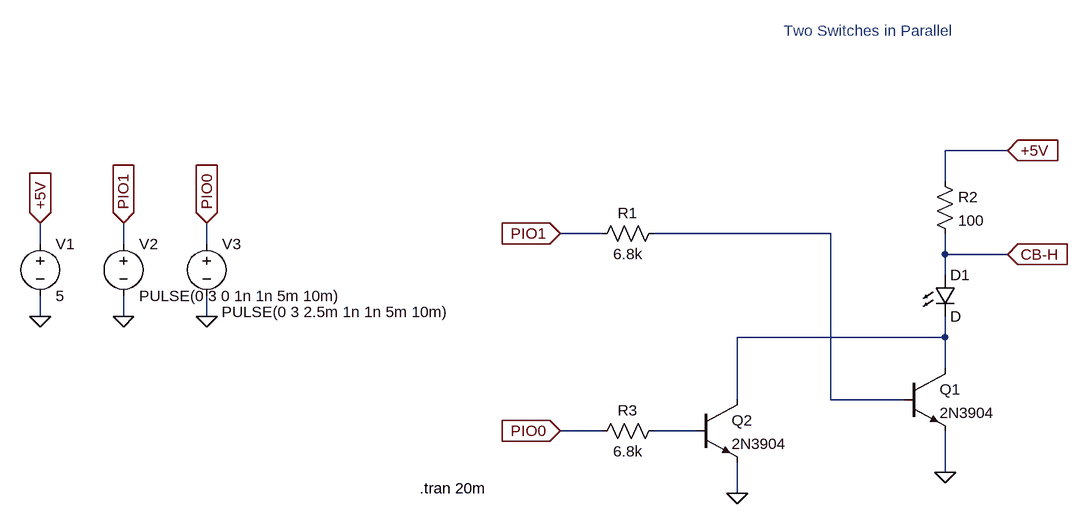
[diagram p0: schematic two_switches_parallel_ltspice.asc]
two_switches_parallel_ltspice.asc, the LTspice schematic file:
Version 4
SHEET 1 880 680
WIRE 368 -224 272 -224
WIRE 272 -176 272 -224
WIRE -256 -96 -320 -96
WIRE 96 -96 -176 -96
WIRE -1120 -80 -1120 -112
WIRE -992 -80 -992 -112
WIRE -864 -80 -864 -112
WIRE 272 -64 272 -96
WIRE 368 -64 272 -64
WIRE 272 -32 272 -64
WIRE -1120 32 -1120 0
WIRE -992 32 -992 0
WIRE -864 32 -864 0
WIRE 272 64 272 32
WIRE 272 64 -48 64
WIRE 272 112 272 64
WIRE -48 160 -48 64
WIRE 96 160 96 -96
WIRE 208 160 96 160
WIRE -256 208 -320 208
WIRE -112 208 -176 208
WIRE 272 272 272 208
WIRE -48 304 -48 256
FLAG 272 272 0
FLAG 368 -224 +5V
IOPIN 368 -224 In
FLAG 368 -64 CB-H
IOPIN 368 -64 In
FLAG -320 -96 PIO1
IOPIN -320 -96 In
FLAG -1120 32 0
FLAG -992 32 0
FLAG -1120 -112 +5V
IOPIN -1120 -112 In
FLAG -992 -112 PIO1
IOPIN -992 -112 In
FLAG -48 304 0
FLAG -320 208 PIO0
IOPIN -320 208 In
FLAG -864 32 0
FLAG -864 -112 PIO0
IOPIN -864 -112 In
SYMBOL res -160 -112 R90
WINDOW 0 0 56 VBottom 2
WINDOW 3 32 56 VTop 2
SYMATTR InstName R1
SYMATTR Value 6.8k
SYMBOL npn 208 112 R0
SYMATTR InstName Q1
SYMATTR Value 2N3904
SYMBOL LED 256 -32 R0
SYMATTR InstName D1
SYMBOL res 256 -192 R0
SYMATTR InstName R2
SYMATTR Value 100
SYMBOL voltage -1120 -96 R0
WINDOW 123 0 0 Left 0
WINDOW 39 0 0 Left 0
SYMATTR InstName V1
SYMATTR Value 5
SYMBOL voltage -992 -96 R0
WINDOW 123 0 0 Left 0
WINDOW 39 0 0 Left 0
SYMATTR InstName V2
SYMATTR Value PULSE(0 3 0 1n 1n 5m 10m)
SYMBOL npn -112 160 R0
SYMATTR InstName Q2
SYMATTR Value 2N3904
SYMBOL res -160 192 R90
WINDOW 0 0 56 VBottom 2
WINDOW 3 32 56 VTop 2
SYMATTR InstName R3
SYMATTR Value 6.8k
SYMBOL voltage -864 -96 R0
WINDOW 123 0 0 Left 0
WINDOW 39 0 0 Left 0
WINDOW 3 23 121 Left 2
SYMATTR InstName V3
SYMATTR Value PULSE(0 3 2.5m 1n 1n 5m 10m)
TEXT -536 296 Left 2 !.tran 20m
TEXT 24 -408 Left 2 ;Two Switches in Parallel

The netlist it stands for:
* two_switches_parallel_ltspice.asc
R1 N001 PIO1 6.8k
Q1 N002 N001 0 0 2N3904
D1 CB-H N002 D
R2 +5V CB-H 100
V1 +5V 0 5
V2 PIO1 0 PULSE(0 3 0 1n 1n 5m 10m)
Q2 N002 N003 0 0 2N3904
R3 N003 PIO0 6.8k
V3 PIO0 0 PULSE(0 3 2.5m 1n 1n 5m 10m)
.model D D
.lib standard.dio
.model NPN NPN
.model PNP PNP
.lib standard.bjt
.tran 20m
* Two Switches in Parallel
.backanno
.end